# EAGLE schematic mlx90614_small (EAGLE 4.16)
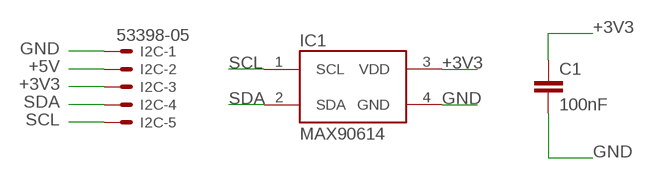
[diagram p0: schematic, sheet 1]

## Parts
C1  100nF  C-EUC0603  [C0603]
I2C  53398-05  [53398-05]
IC1  MAX90614  MLX90614  [TO39/4]

## Nets
+3V3: C1.1 I2C.3 IC1.3(VDD)
+5V: I2C.2
GND: C1.2 I2C.1 IC1.4(GND)
SCL: I2C.5 IC1.1(SCL)
SDA: I2C.4 IC1.2(SDA)

## Library data of the parts
C1 = rcl:C-EU: CAPACITOR, European symbol
I2C = con-molex:53?-05: CONNECTOR wire to board 1.25 mm (.049 inch) pitch header
IC1 = paparazzi_mm:MLX90614